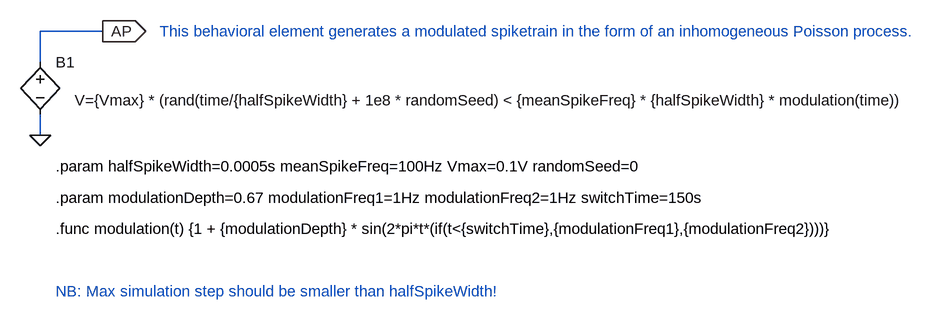
[diagram p0: schematic spiketrain.asc]
spiketrain.asc, the LTspice schematic file:
Version 4
SHEET 1 2640 680
WIRE 256 32 160 32
WIRE 160 80 160 32
WIRE 160 192 160 160
FLAG 160 192 0
FLAG 256 32 AP
IOPIN 256 32 Out
SYMBOL bv 160 64 R0
WINDOW 3 53 74 Left 2
SYMATTR Value V={Vmax} * (rand(time/{halfSpikeWidth} + 1e8 * randomSeed) < {meanSpikeFreq} * {halfSpikeWidth} * modulation(time))
SYMATTR InstName B1
TEXT 184 240 Left 2 !.param halfSpikeWidth=0.0005s meanSpikeFreq=100Hz Vmax=0.1V randomSeed=0
TEXT 184 432 Left 2 ;NB: Max simulation step should be smaller than halfSpikeWidth!
TEXT 184 336 Left 2 !.func modulation(t) {1 + {modulationDepth} * sin(2*pi*t*(if(t<{switchTime},{modulationFreq1},{modulationFreq2})))}
TEXT 344 32 Left 2 ;This behavioral element generates a modulated spiketrain in the form of an inhomogeneous Poisson process.
TEXT 184 288 Left 2 !.param modulationDepth=0.67 modulationFreq1=1Hz modulationFreq2=1Hz switchTime=150s

The netlist it stands for:
* spiketrain.asc
B1 AP 0 V={Vmax} * (rand(time/{halfSpikeWidth} + 1e8 * randomSeed) < {meanSpikeFreq} * {halfSpikeWidth} * modulation(time))
.param halfSpikeWidth=0.0005s meanSpikeFreq=100Hz Vmax=0.1V randomSeed=0
* NB: Max simulation step should be smaller than halfSpikeWidth!
.func modulation(t) {1 + {modulationDepth} * sin(2*pi*t*(if(t<{switchTime},{modulationFreq1},{modulationFreq2})))}
* This behavioral element generates a modulated spiketrain in the form of an inhomogeneous Poisson process.
.param modulationDepth=0.67 modulationFreq1=1Hz modulationFreq2=1Hz switchTime=150s
.backanno
.end